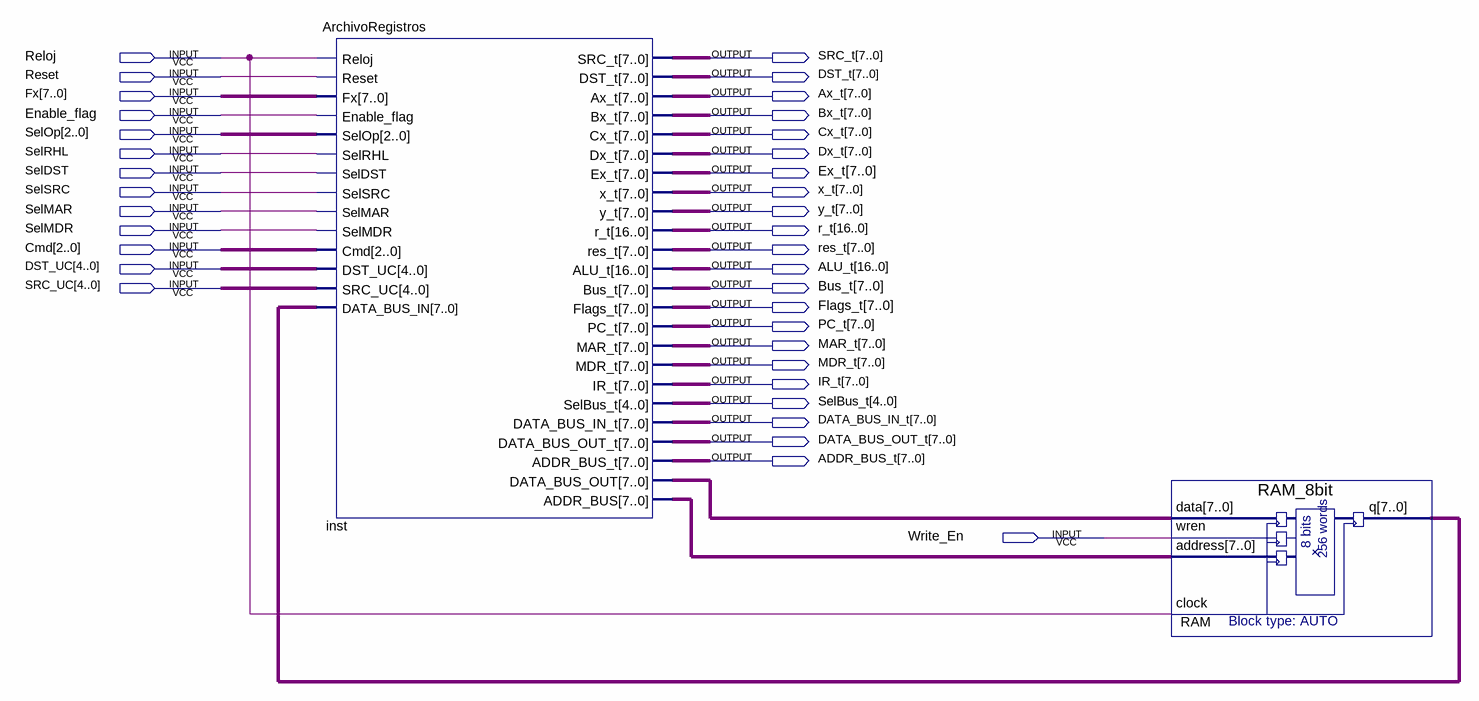
[diagram p0: schematic sheet]
// Quartus schematic MiQRObio.bdf as structural Verilog: 2 symbols, 36 pins
module MiQRObio (
  input  Reloj,
  input  Reset,
  input  [7:0] Fx,
  input  Enable_flag,
  input  [2:0] SelOp,
  input  SelRHL,
  input  SelDST,
  input  SelSRC,
  input  SelMAR,
  input  SelMDR,
  input  [2:0] Cmd,
  input  [4:0] DST_UC,
  input  [4:0] SRC_UC,
  input  Write_En,
  output [7:0] SRC_t,
  output [7:0] DST_t,
  output [7:0] Ax_t,
  output [7:0] Bx_t,
  output [7:0] Cx_t,
  output [7:0] Dx_t,
  output [7:0] Ex_t,
  output [7:0] x_t,
  output [7:0] y_t,
  output [16:0] r_t,
  output [7:0] res_t,
  output [16:0] ALU_t,
  output [7:0] Bus_t,
  output [7:0] Flags_t,
  output [7:0] PC_t,
  output [7:0] MAR_t,
  output [7:0] MDR_t,
  output [7:0] IR_t,
  output [4:0] SelBus_t,
  output [7:0] DATA_BUS_IN_t,
  output [7:0] DATA_BUS_OUT_t,
  output [7:0] ADDR_BUS_t
);

  wire [7:0] inst_addr_bus, inst_data_bus_out, RAM_q;

  ArchivoRegistros inst (
    .Reloj(Reloj), .Reset(Reset), .Fx(Fx), .Enable_flag(Enable_flag), .SelOp(SelOp), .SelRHL(SelRHL),
    .SelDST(SelDST), .SelSRC(SelSRC), .SelMAR(SelMAR), .SelMDR(SelMDR), .Cmd(Cmd), .DST_UC(DST_UC),
    .SRC_UC(SRC_UC), .DATA_BUS_IN(RAM_q), .SRC_t(SRC_t), .DST_t(DST_t), .Ax_t(Ax_t), .Bx_t(Bx_t),
    .Cx_t(Cx_t), .Dx_t(Dx_t), .Ex_t(Ex_t), .x_t(x_t), .y_t(y_t), .r_t(r_t), .res_t(res_t), .ALU_t(ALU_t),
    .Bus_t(Bus_t), .Flags_t(Flags_t), .PC_t(PC_t), .MAR_t(MAR_t), .MDR_t(MDR_t), .IR_t(IR_t),
    .SelBus_t(SelBus_t), .DATA_BUS_IN_t(DATA_BUS_IN_t), .DATA_BUS_OUT_t(DATA_BUS_OUT_t),
    .ADDR_BUS_t(ADDR_BUS_t), .DATA_BUS_OUT(inst_data_bus_out), .ADDR_BUS(inst_addr_bus));
  RAM_8bit RAM (.data(inst_data_bus_out), .wren(Write_En), .address(inst_addr_bus), .clock(Reloj), .q(RAM_q));
endmodule
